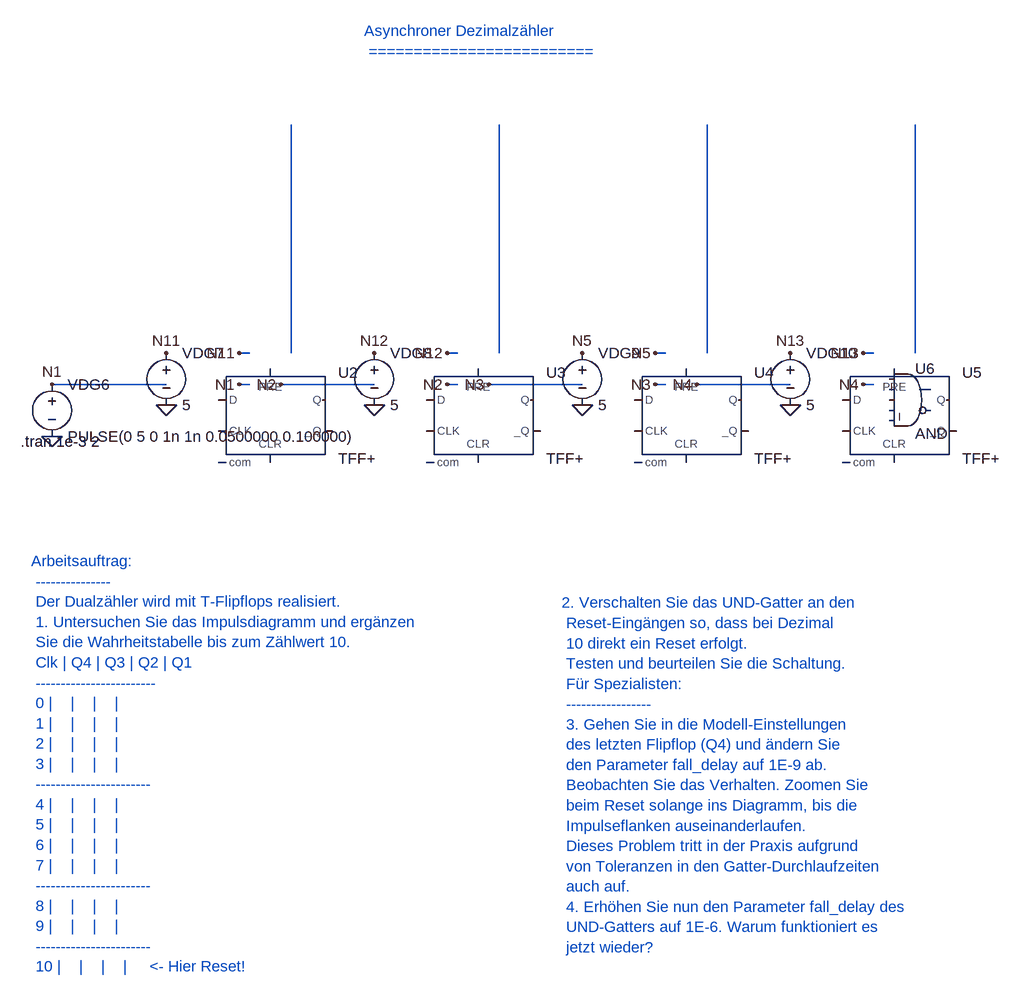
[diagram p0: schematic 6_2_2_Asynchroner_Dezimalzähler.asc]
6_2_2_Asynchroner_Dezimalzähler.asc, the LTspice schematic file:
Version 4
SHEET 1 880 680
WIRE 480 192 480 544
WIRE 1120 192 1120 544
WIRE 800 192 800 544
WIRE 1440 192 1440 544
WIRE 112 592 288 592
WIRE 480 592 608 592
WIRE 800 592 928 592
WIRE 1120 592 1248 592
WIRE 416 592 400 592
WIRE 416 544 400 544
WIRE 480 592 464 592
WIRE 736 592 720 592
WIRE 800 592 784 592
WIRE 1056 592 1040 592
WIRE 1120 592 1104 592
WIRE 1376 592 1360 592
WIRE 1056 544 1040 544
WIRE 736 544 720 544
WIRE 1376 544 1360 544
FLAG 112 672 0
FLAG 288 624 0
FLAG 608 624 0
FLAG 928 624 0
FLAG 1248 624 0
FLAG 112 592 N1
FLAG 400 592 N1
FLAG 288 544 N11
FLAG 400 544 N11
FLAG 464 592 N2
FLAG 720 592 N2
FLAG 784 592 N3
FLAG 1040 592 N3
FLAG 1104 592 N4
FLAG 1360 592 N4
FLAG 1040 544 N5
FLAG 928 544 N5
FLAG 720 544 N12
FLAG 608 544 N12
FLAG 1360 544 N13
FLAG 1248 544 N13
SYMBOL voltage 112 576 R0
SYMATTR InstName VDG6
SYMATTR Value PULSE(0 5 0 1n 1n 0.0500000 0.100000)
SYMBOL Digital\dflop 448 568 R0
SYMATTR InstName U2
SYMATTR Value TFF+
SYMATTR LibreSpice kind=tff;edge=rising;async=high;vth=2.5;vhigh=5;pins=T,CLK,SET,RESET,Q,~Q
SYMBOL voltage 288 528 R0
SYMATTR InstName VDG7
SYMATTR Value 5
SYMBOL Digital\dflop 768 568 R0
SYMATTR InstName U3
SYMATTR Value TFF+
SYMATTR LibreSpice kind=tff;edge=rising;async=high;vth=2.5;vhigh=5;pins=T,CLK,SET,RESET,Q,~Q
SYMBOL Digital\dflop 1088 568 R0
SYMATTR InstName U4
SYMATTR Value TFF+
SYMATTR LibreSpice kind=tff;edge=rising;async=high;vth=2.5;vhigh=5;pins=T,CLK,SET,RESET,Q,~Q
SYMBOL Digital\dflop 1408 568 R0
SYMATTR InstName U5
SYMATTR Value TFF+
SYMATTR LibreSpice kind=tff;edge=rising;async=high;vth=2.5;vhigh=5;pins=T,CLK,SET,RESET,Q,~Q
SYMBOL voltage 608 528 R0
SYMATTR InstName VDG8
SYMATTR Value 5
SYMBOL voltage 928 528 R0
SYMATTR InstName VDG9
SYMATTR Value 5
SYMBOL voltage 1248 528 R0
SYMATTR InstName VDG10
SYMATTR Value 5
SYMBOL Digital\and 1432 552 R0
SYMATTR InstName U6
SYMATTR Value AND
SYMATTR LibreSpice gate=and;inputs=2;vth=2.5;vhigh=5;pins=In1,In2,Out
TEXT 64 680 Left 2 !.tran 1e-3 2
TEXT 80 864 Left 2 ;Arbeitsauftrag: \n --------------- \n Der Dualzähler wird mit T-Flipflops realisiert. \n 1. Untersuchen Sie das Impulsdiagramm und ergänzen \n Sie die Wahrheitstabelle bis zum Zählwert 10. \n Clk | Q4 | Q3 | Q2 | Q1 \n ------------------------ \n 0 |    |    |    | \n 1 |    |    |    | \n 2 |    |    |    | \n 3 |    |    |    | \n ----------------------- \n 4 |    |    |    | \n 5 |    |    |    | \n 6 |    |    |    | \n 7 |    |    |    | \n ----------------------- \n 8 |    |    |    | \n 9 |    |    |    | \n ----------------------- \n 10 |    |    |    |     <- Hier Reset!
TEXT 592 48 Left 2 ;Asynchroner Dezimalzähler \n =========================
TEXT 896 928 Left 2 ;2. Verschalten Sie das UND-Gatter an den \n Reset-Eingängen so, dass bei Dezimal \n 10 direkt ein Reset erfolgt. \n Testen und beurteilen Sie die Schaltung. \n Für Spezialisten: \n ----------------- \n 3. Gehen Sie in die Modell-Einstellungen \n des letzten Flipflop (Q4) und ändern Sie \n den Parameter fall_delay auf 1E-9 ab. \n Beobachten Sie das Verhalten. Zoomen Sie \n beim Reset solange ins Diagramm, bis die \n Impulseflanken auseinanderlaufen. \n Dieses Problem tritt in der Praxis aufgrund \n von Toleranzen in den Gatter-Durchlaufzeiten \n auch auf. \n 4. Erhöhen Sie nun den Parameter fall_delay des \n UND-Gatters auf 1E-6. Warum funktioniert es \n jetzt wieder?

The netlist it stands for:
* 6_2_2_Asynchroner_Dezimalzähler.asc
VDG6 N1 0 PULSE(0 5 0 1n 1n 0.0500000 0.100000)
A§U2 0 0 0 0 0 0 0 0 DFLOP TFF+
VDG7 N11 0 5
A§U3 0 0 0 0 0 0 0 0 DFLOP TFF+
A§U4 0 0 0 0 0 0 0 0 DFLOP TFF+
A§U5 0 0 0 0 0 0 0 0 DFLOP TFF+
VDG8 N12 0 5
VDG9 N5 0 5
VDG10 N13 0 5
A§U6 0 0 0 0 0 0 0 0 AND AND
.tran 1e-3 2
* Arbeitsauftrag:
*  ---------------
*  Der Dualzähler wird mit T-Flipflops realisiert.
*  1. Untersuchen Sie das Impulsdiagramm und ergänzen
*  Sie die Wahrheitstabelle bis zum Zählwert 10.
*  Clk | Q4 | Q3 | Q2 | Q1
*  ------------------------
*  0 |    |    |    |
*  1 |    |    |    |
*  2 |    |    |    |
*  3 |    |    |    |
*  -----------------------
*  4 |    |    |    |
*  5 |    |    |    |
*  6 |    |    |    |
*  7 |    |    |    |
*  -----------------------
*  8 |    |    |    |
*  9 |    |    |    |
*  -----------------------
*  10 |    |    |    |     <- Hier Reset!
* Asynchroner Dezimalzähler
*  =========================
* 2. Verschalten Sie das UND-Gatter an den
*  Reset-Eingängen so, dass bei Dezimal
*  10 direkt ein Reset erfolgt.
*  Testen und beurteilen Sie die Schaltung.
*  Für Spezialisten:
*  -----------------
*  3. Gehen Sie in die Modell-Einstellungen
*  des letzten Flipflop (Q4) und ändern Sie
*  den Parameter fall_delay auf 1E-9 ab.
*  Beobachten Sie das Verhalten. Zoomen Sie
*  beim Reset solange ins Diagramm, bis die
*  Impulseflanken auseinanderlaufen.
*  Dieses Problem tritt in der Praxis aufgrund
*  von Toleranzen in den Gatter-Durchlaufzeiten
*  auch auf.
*  4. Erhöhen Sie nun den Parameter fall_delay des
*  UND-Gatters auf 1E-6. Warum funktioniert es
*  jetzt wieder?
.backanno
.end